# Altium schematic sheet WS2812B.SchDoc
size A4
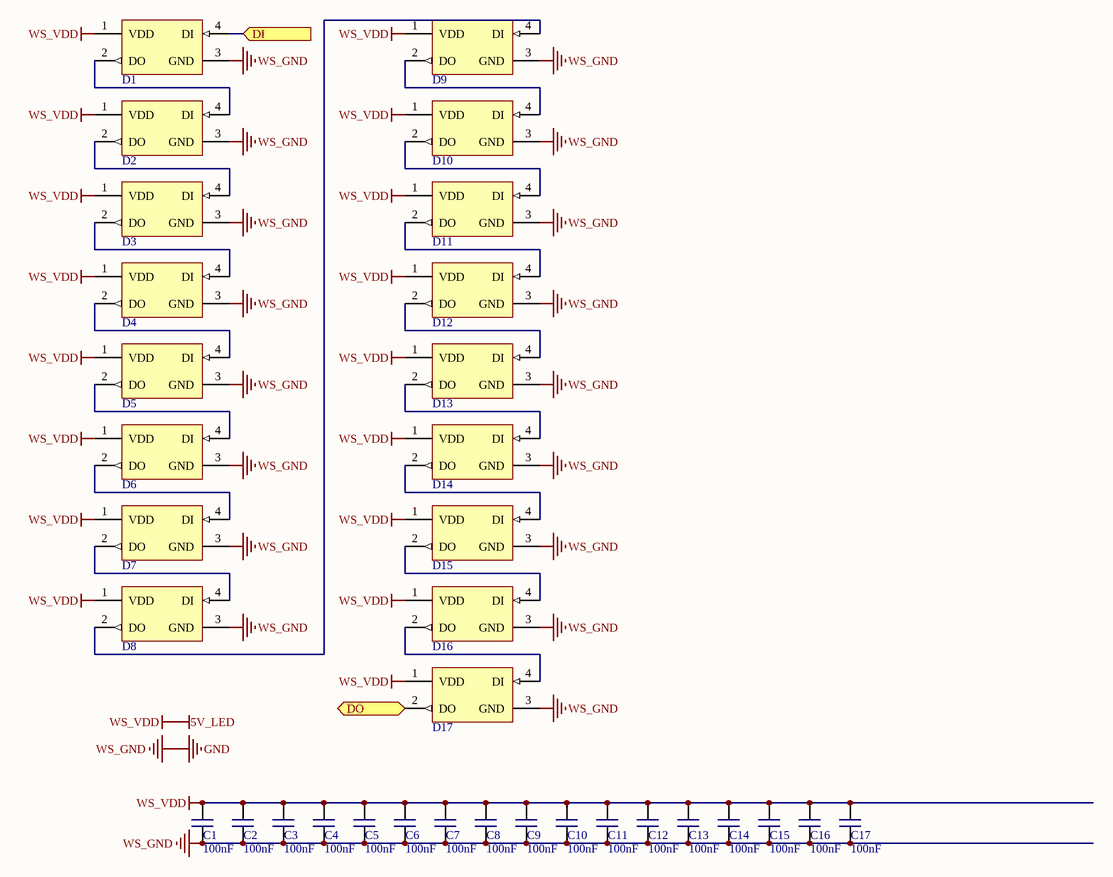
[diagram p0: WS2812B.SchDoc]

## Parts
C1  100nF  [C0603H08_M]
C2  100nF  [C0603H08_M]
C3  100nF  [C0603H08_M]
C4  100nF  [C0603H08_M]
C5  100nF  [C0603H08_M]
C6  100nF  [C0603H08_M]
C7  100nF  [C0603H08_M]
C8  100nF  [C0603H08_M]
C9  100nF  [C0603H08_M]
C10  100nF  [C0603H08_M]
C11  100nF  [C0603H08_M]
C12  100nF  [C0603H08_M]
C13  100nF  [C0603H08_M]
C14  100nF  [C0603H08_M]
C15  100nF  [C0603H08_M]
C16  100nF  [C0603H08_M]
C17  100nF  [C0603H08_M]
D1  WS2812B  [WS2812B]  (value not drawn)
D2  WS2812B  [WS2812B]  (value not drawn)
D3  WS2812B  [WS2812B]  (value not drawn)
D4  WS2812B  [WS2812B]  (value not drawn)
D5  WS2812B  [WS2812B]  (value not drawn)
D6  WS2812B  [WS2812B]  (value not drawn)
D7  WS2812B  [WS2812B]  (value not drawn)
D8  WS2812B  [WS2812B]  (value not drawn)
D9  WS2812B  [WS2812B]  (value not drawn)
D10  WS2812B  [WS2812B]  (value not drawn)
D11  WS2812B  [WS2812B]  (value not drawn)
D12  WS2812B  [WS2812B]  (value not drawn)
D13  WS2812B  [WS2812B]  (value not drawn)
D14  WS2812B  [WS2812B]  (value not drawn)
D15  WS2812B  [WS2812B]  (value not drawn)
D16  WS2812B  [WS2812B]  (value not drawn)
D17  WS2812B  [WS2812B]  (value not drawn)

## Ports
DI (in), DO (out)

## Nets
5V_LED: C1.2 C2.2 C3.2 C4.2 C5.2 C6.2 C7.2 C8.2 C9.2 C10.2 C11.2 C12.2 C13.2 C14.2 C15.2 C16.2 C17.2 D1.1(VDD) D2.1(VDD) D3.1(VDD) D4.1(VDD) D5.1(VDD) D6.1(VDD) D7.1(VDD) D8.1(VDD) D9.1(VDD) D10.1(VDD) D11.1(VDD) D12.1(VDD) D13.1(VDD) D14.1(VDD) D15.1(VDD) D16.1(VDD) D17.1(VDD)  [also labelled WS_VDD]
GND: C1.1 C2.1 C3.1 C4.1 C5.1 C6.1 C7.1 C8.1 C9.1 C10.1 C11.1 C12.1 C13.1 C14.1 C15.1 C16.1 C17.1 D1.3(GND) D2.3(GND) D3.3(GND) D4.3(GND) D5.3(GND) D6.3(GND) D7.3(GND) D8.3(GND) D9.3(GND) D10.3(GND) D11.3(GND) D12.3(GND) D13.3(GND) D14.3(GND) D15.3(GND) D16.3(GND) D17.3(GND)  [also labelled WS_GND]
DI: D1.4(DI) ; port DI
DO: D17.2(DO) ; port DO
NetD1_2: D1.2(DO) D2.4(DI)
NetD2_2: D2.2(DO) D3.4(DI)
NetD3_2: D3.2(DO) D4.4(DI)
NetD4_2: D4.2(DO) D5.4(DI)
NetD5_2: D5.2(DO) D6.4(DI)
NetD6_2: D6.2(DO) D7.4(DI)
NetD7_2: D7.2(DO) D8.4(DI)
NetD8_2: D8.2(DO) D9.4(DI)
NetD9_2: D9.2(DO) D10.4(DI)
NetD10_2: D10.2(DO) D11.4(DI)
NetD11_2: D11.2(DO) D12.4(DI)
NetD12_2: D12.2(DO) D13.4(DI)
NetD13_2: D13.2(DO) D14.4(DI)
NetD14_2: D14.2(DO) D15.4(DI)
NetD15_2: D15.2(DO) D16.4(DI)
NetD16_2: D16.2(DO) D17.4(DI)

## Library data of the parts
C1-C17 = C 100nF 100V 0603 MLCC X7R: Form: 0603 [M 1608]; Temperature Coeffizient: 0ppm/°C +- 30ppm/°C; Tolerance: +-10%; Price: 0.044; Series: X7R; Voltage Rating: 100V; Temperature Range: -55°C to +125°C; Value: 100nF
D1-D17 = WS2812B: WS2812B RGB LED